# EAGLE design mega_shield2 (EAGLE 7.6.0)
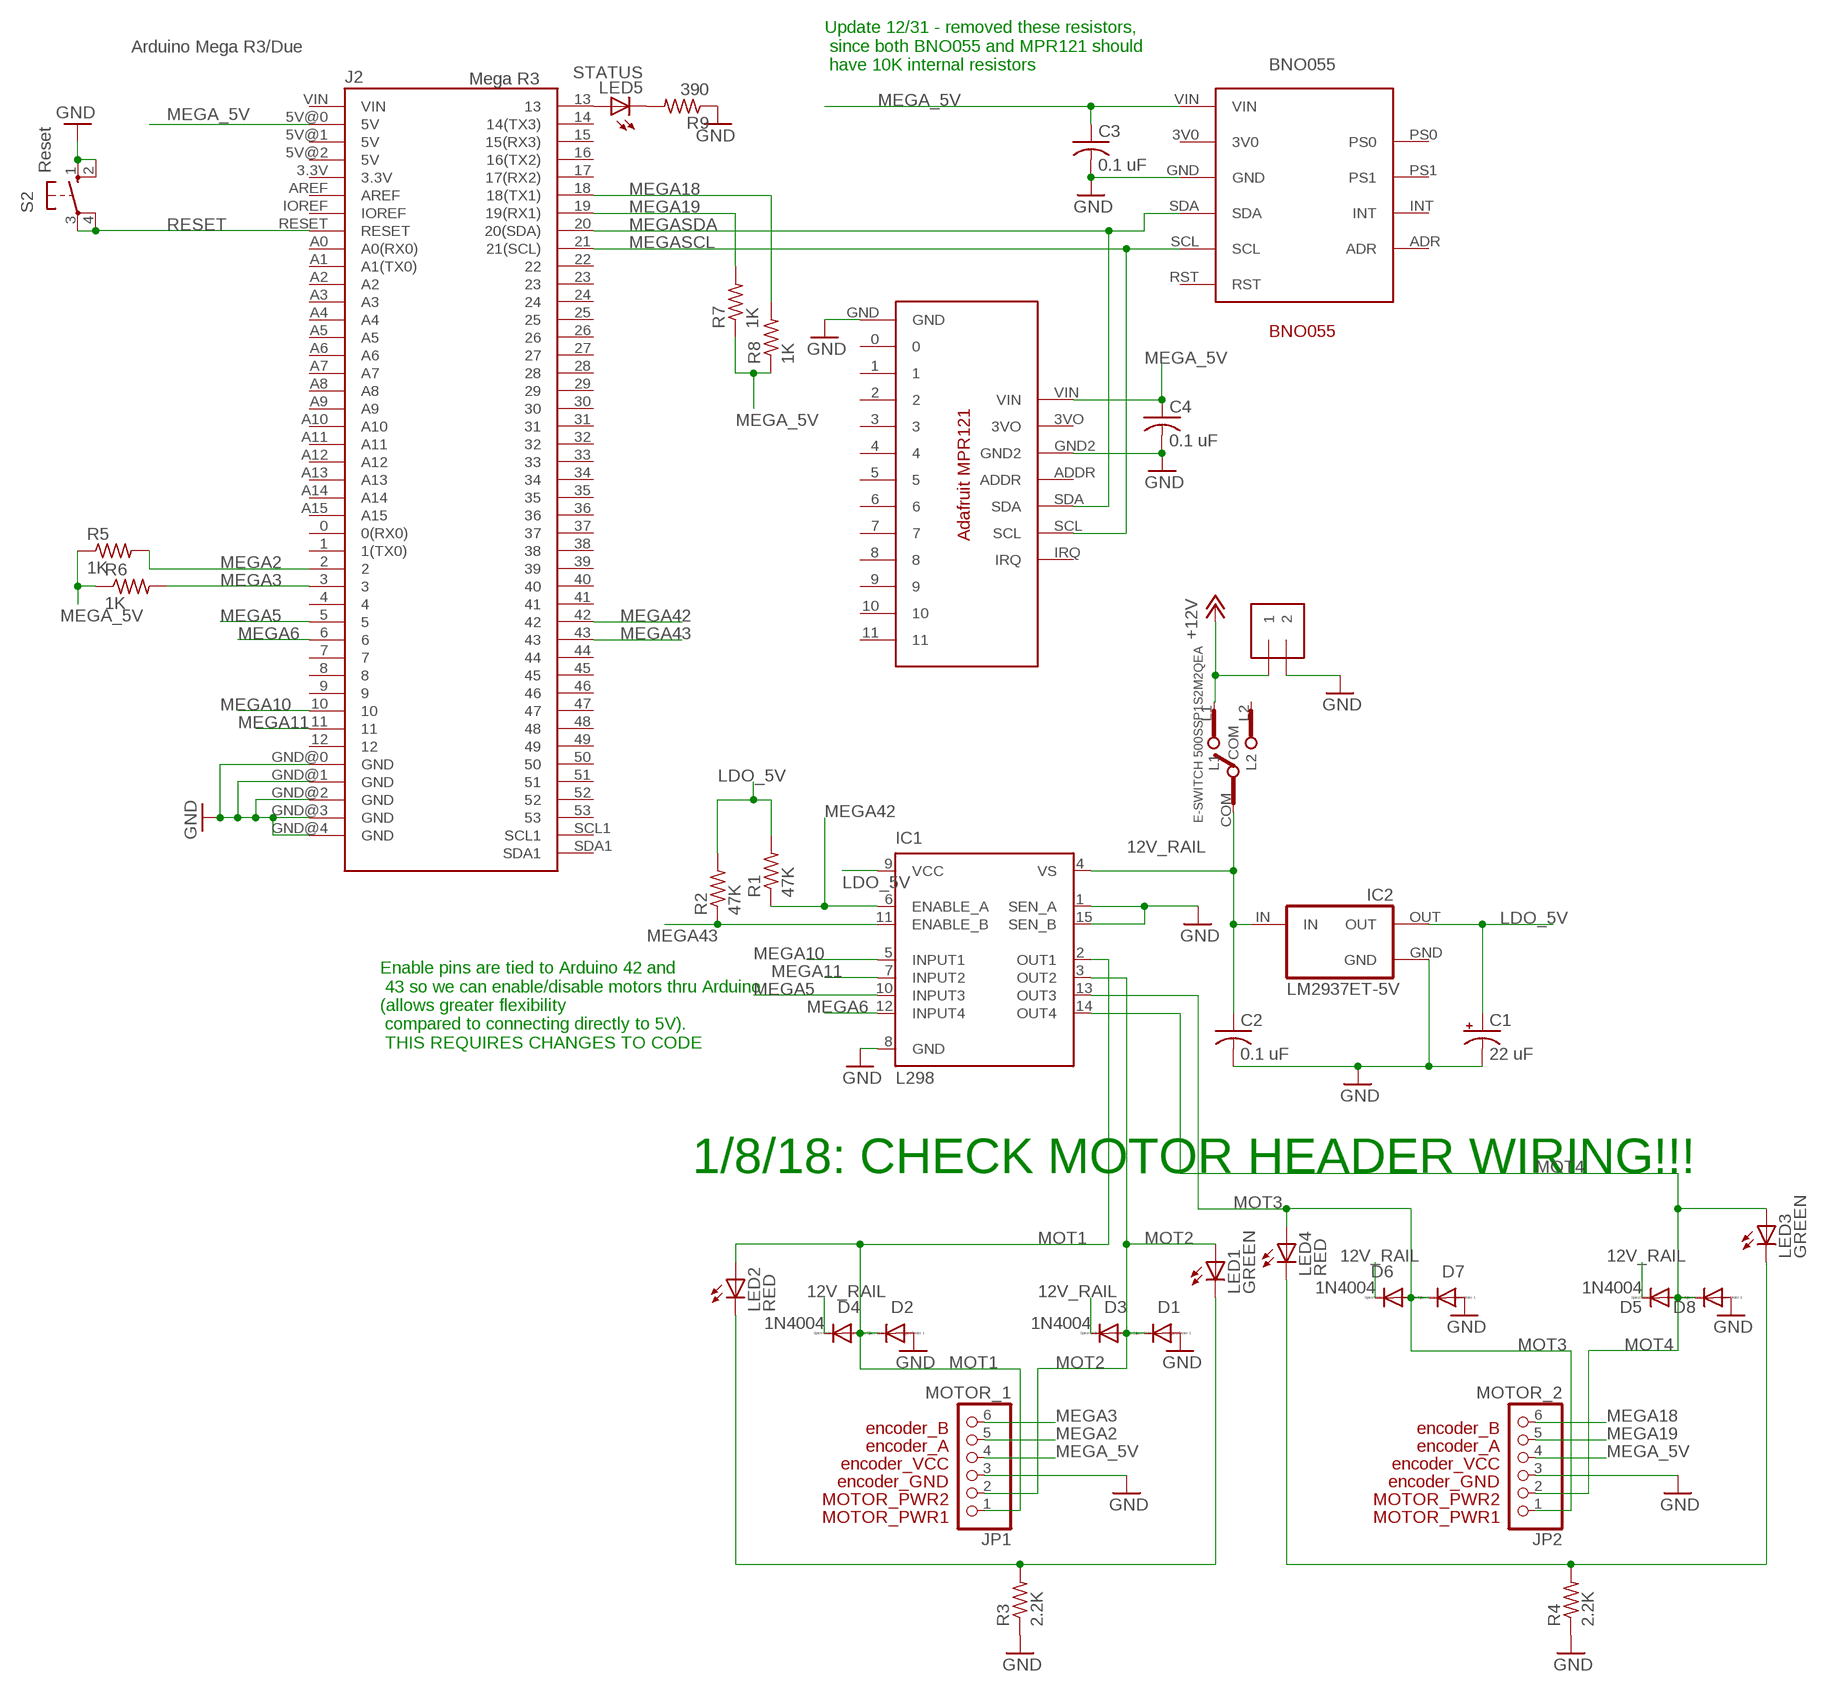
[diagram p0: schematic, sheet 1]

## Parts
12V_IN  1X2-3.5MM  [1X2-3.5MM]
BNO055  BNO055  [BNO055]
C1  22 uF  CPOL-USB45181A  [B45181A]
C2  0.1 uF  C-US025-050X050  [C025-050X050]
C3  0.1 uF  C-US025-050X050  [C025-050X050]
C4  0.1 uF  C-US025-050X050  [C025-050X050]
D1  1N4004  [DO41-10]
D2  1N4004  [DO41-10]
D3  1N4004  [DO41-10]
D4  1N4004  [DO41-10]
D5  1N4004  [DO41-10]
D6  1N4004  [DO41-10]
D7  1N4004  [DO41-10]
D8  1N4004  [DO41-10]
IC1  L298  [MULTIWATT-15]
IC2  LM2937ET-5V  LM2937ET-5,0  [TO220(V)]
J2  Mega R3  ARDUINO-MEGAFULL  [ARDUINO_MEGA]
JP1  MOTOR_1  PINHD-1X6  [1X06]
JP2  MOTOR_2  PINHD-1X6  [1X06]
LED1  GREEN  LED3MM  [LED3MM]
LED2  RED  LED3MM  [LED3MM]
LED3  GREEN  LED3MM  [LED3MM]
LED4  RED  LED3MM  [LED3MM]
LED5  STATUS  LED3MM  [LED3MM]
MPR121  ADA_MPR121  [ADA_MPR121]
R1  47K  R-US_0207/10  [0207/10]
R2  47K  R-US_0207/10  [0207/10]
R3  2.2K  R-US_0207/10  [0207/10]
R4  2.2K  R-US_0207/10  [0207/10]
R5  1K  R-US_0207/10  [0207/10]
R6  1K  R-US_0207/10  [0207/10]
R7  1K  R-US_0207/10  [0207/10]
R8  1K  R-US_0207/10  [0207/10]
R9  390  R-US_0207/10  [0207/10]
S2  Reset  10-XX  [B3F-10XX]
SLIDE_SW  E-SWITCH_500SSP1S2M2QEA  [E-SWITCH_500SSP1S2M2QEA]

## Nets
12V_RAIL [12V_PWR]: C2.1 D3.C D4.C D5.C D6.C IC1.4(VS) IC2.IN SLIDE_SW.COM
+12V [12V_PWR]: 12V_IN.1 SLIDE_SW.L1
GND: 12V_IN.2 BNO055.GND C1.- C2.2 C3.2 C4.2 D1.A D2.A D7.A D8.A IC1.1(SEN_A) IC1.8(GND) IC1.15(SEN_B) IC2.GND J2.GND@0(GND) J2.GND@1(GND) J2.GND@2(GND) J2.GND@3(GND) J2.GND@4(GND) JP1.3 JP2.3 MPR121.GND MPR121.GND2 R3.1 R4.1 R9.1 S2.1(S) S2.2(S1)
LDO_5V [5V_LDO]: C1.+ IC1.9(VCC) IC2.OUT R1.2 R2.2
MEGA2: J2.2 JP1.5 R5.2
MEGA3: J2.3 JP1.6 R6.2
MEGA5: IC1.10(INPUT3) J2.5
MEGA6: IC1.12(INPUT4) J2.6
MEGA10: IC1.5(INPUT1) J2.10
MEGA11: IC1.7(INPUT2) J2.11
MEGA18: J2.18(18(TX1)) JP2.6 R8.2
MEGA19: J2.19(19(RX1)) JP2.5 R7.2
MEGA42: IC1.6(ENABLE_A) J2.42 R1.1
MEGA43: IC1.11(ENABLE_B) J2.43 R2.1
MEGA_5V [5V_LDO]: BNO055.VIN C3.1 C4.1 J2.5V@0(5V) JP1.4 JP2.4 MPR121.VIN R5.1 R6.1 R7.1 R8.1
MEGASCL: BNO055.SCL J2.21(21(SCL)) MPR121.SCL
MEGASDA: BNO055.SDA J2.20(20(SDA)) MPR121.SDA
MOT1 [12V_PWR]: D2.C D4.A IC1.2(OUT1) JP1.1 LED2.A
MOT2 [12V_PWR]: D1.C D3.A IC1.3(OUT2) JP1.2 LED1.A
MOT3 [12V_PWR]: D6.A D7.C IC1.13(OUT3) JP2.1 LED4.A
MOT4 [12V_PWR]: D5.A D8.C IC1.14(OUT4) JP2.2 LED3.A
N$3: J2.13 LED5.A
N$4: LED5.K(C) R9.2
N$7: LED1.K(C) LED2.K(C) R3.2
N$12: LED3.K(C) LED4.K(C) R4.2
RESET: J2.RESET S2.3(P) S2.4(P1)
Unconnected: BNO055.3V0 BNO055.ADR BNO055.INT BNO055.PS0 BNO055.PS1 BNO055.RST J2.0(0(RX0)) J2.1(1(TX0)) J2.3.3V J2.4 J2.5V@1(5V) J2.5V@2(5V) J2.7 J2.8 J2.9 J2.12 J2.14(14(TX3)) J2.15(15(RX3)) J2.16(16(TX2)) J2.17(17(RX2)) J2.22 J2.23 J2.24 J2.25 J2.26 J2.27 J2.28 J2.29 J2.30 J2.31 J2.32 J2.33 J2.34 J2.35 J2.36 J2.37 J2.38 J2.39 J2.40 J2.41 J2.44 J2.45 J2.46 J2.47 J2.48 J2.49 J2.50 J2.51 J2.52 J2.53 J2.A0(A0(RX0)) J2.A1(A1(TX0)) J2.A2 J2.A3 J2.A4 J2.A5 J2.A6 J2.A7 J2.A8 J2.A9 J2.A10 J2.A11 J2.A12 J2.A13 J2.A14 J2.A15 J2.AREF J2.IOREF J2.SCL1 J2.SDA1 J2.VIN MPR121.0 MPR121.1 MPR121.2 MPR121.3 MPR121.3VO MPR121.4 MPR121.5 MPR121.6 MPR121.7 MPR121.8 MPR121.9 MPR121.10 MPR121.11 MPR121.ADDR MPR121.IRQ SLIDE_SW.L2

## Notes on the sheet
- Arduino Mega R3/Due
- Update 12/31 - removed these resistors,
   since both BNO055 and MPR121 should
   have 10K internal resistors
- Enable pins are tied to Arduino 42 and
   43 so we can enable/disable motors thru Arduino 
  (allows greater flexibility
   compared to connecting directly to 5V).
   THIS REQUIRES CHANGES TO CODE
- 1/8/18: CHECK MOTOR HEADER WIRING!!!

## Library data of the parts
12V_IN = adafruit:1X2: 3.5mm Terminal block http://www.ladyada.net/library/pcb/eaglelibrary.html
BNO055 = arduinoShield:BNO055
C1 = rcl:CPOL-US: POLARIZED CAPACITOR, American symbol
C2-C4 = rcl:C-US: CAPACITOR, American symbol
D1-D8 = diode:1N4004: DIODE general purpose rectifier, 1 A
IC1 = st-microelectronics:L298: DUAL FULL-BRIDGE DRIVER; MPN: L298N; OC_FARNELL: 1589425; OC_NEWARK: 32M1527
IC2 = lm2937:LM2937ET*: 400 and 500 mA Low Dropout Voltage Regulator NATIONAL SEMICONDUCTOR created by Peter.Hofmann@ph-tronic.de <mailto:Reter.Hofmann@ph-tronic.de> 10-2004 Rev.0
J2 = zortness:ARDUINO-MEGA: Arduino MegaR3 board footprint. Also works for Due.
JP1 JP2 = adafruit:PINHD-1X6: PIN HEADER
LED1-LED5 = adafruit:LED: LED OSRAM: - CHIPLED LG R971, LG N971, LY N971, LG Q971, LY Q971, LO R971, LY R971 LH N974, LH R974 LS Q976, LO Q976, LY Q976 LO Q996 - Hyper CHIPLED LW Q18S LB Q993, LB Q99A, LB R99A - SideLED LS A670, LO A670, LY A670, LG A670, LP A670 LB A673, LV A673, LT A673, LW A673 LH A674 LY A675 LS A676, LA A676, LO A676, LY A676, LW A676 LS A679, LY A679, LG A679 - Hyper Micro SIDELED® LS Y876, LA Y876, LO Y876, LY Y876 LT Y87S - SmartLED LW L88C, LW L88S LB L89C, LB L89S, LG L890 LS L89K, LO L89K, LY L89K LS L896, LA L896, LO L896, LY L896 - TOPLED LS T670, LO T670, LY T670, LG T670, LP T670 LSG T670, LSP T670, LSY T670, LOP T670, LYG T670 LG T671, LOG T671, LSG T671 LB T673, LV T673, LT T673, LW T673 LH T674 LS T676, LA T676, LO T676, LY T676, LB T676, LH T676, LSB T676, LW T676 LB T67C, LV T67C, LT T67C, LS T67K, LO T67K, LY T67K, LW E67C LS E67B, LA E67B, LO E67B, LY E67B, LB E67C, LV E67C, LT E67C LW T67C LS T679, LY T679, LG T679 LS T770, LO T770, LY T770, LG T770, LP T770 LB T773, LV T773, LT T773, LW T773 LH T774 LS E675, LA E675, LY E675, LS T675 LS T776, LA T776, LO T776, LY T776, LB T776 LHGB T686 LT T68C, LB T68C - Hyper Mini TOPLED® LB M676 - Mini TOPLED Santana® LG M470 LS M47K, LO M47K, LY M47K Source: http://www.osram.convergy.de/
MPR121 = arduinoShield:ADA_MPR121
R1-R9 = rcl:R-US_: RESISTOR, American symbol
S2 = switch-omron:10-XX: OMRON SWITCH; MPN: B3F-1000; OC_FARNELL: 176432; OC_NEWARK: 36M3542
SLIDE_SW = arduinoShield:E-SWITCH_500SSP1S2M2QEA

## Net classes
1 12V_PWR: width 2.159 mm
2 5V_LDO: width 0.305 mm

## Board
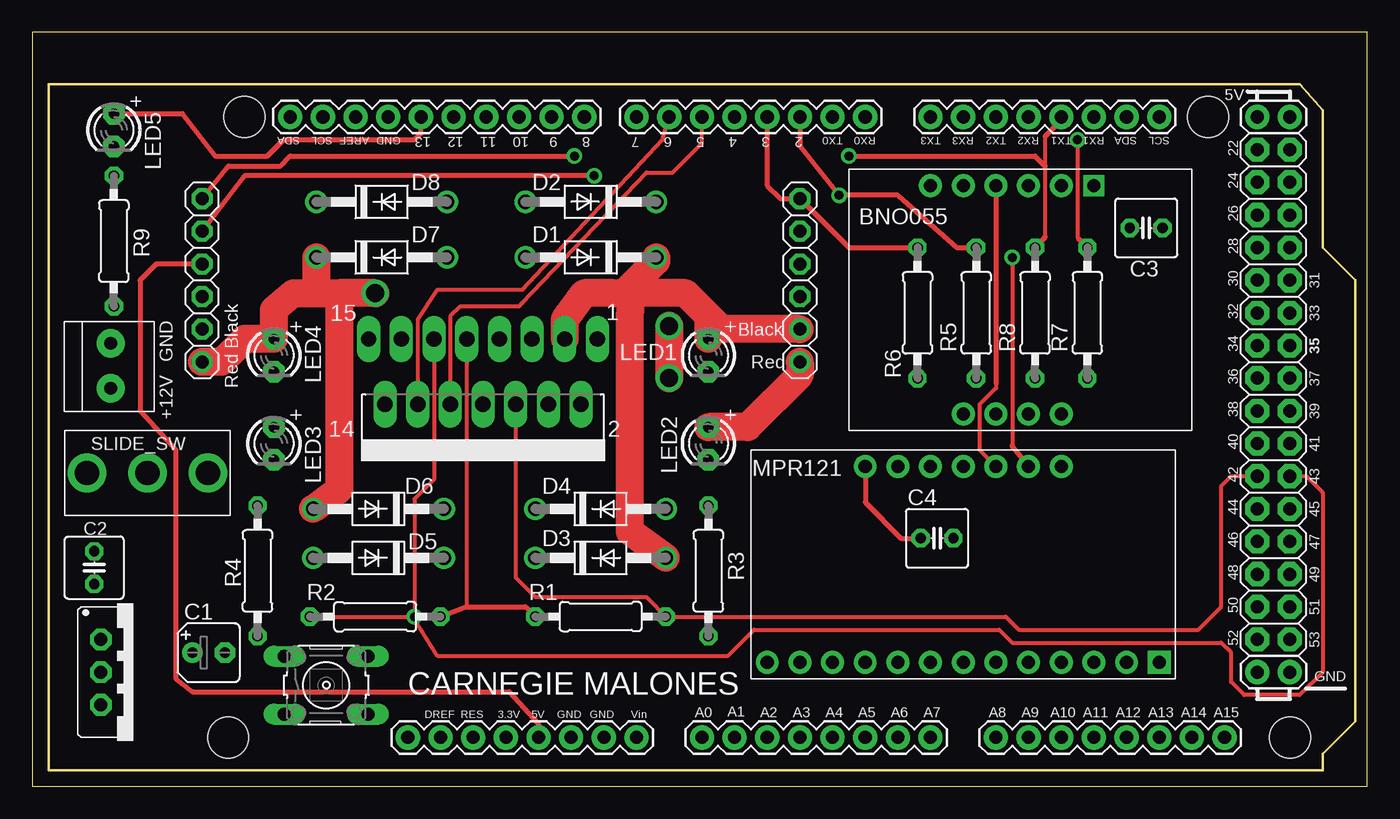
[diagram p1: board, top side]
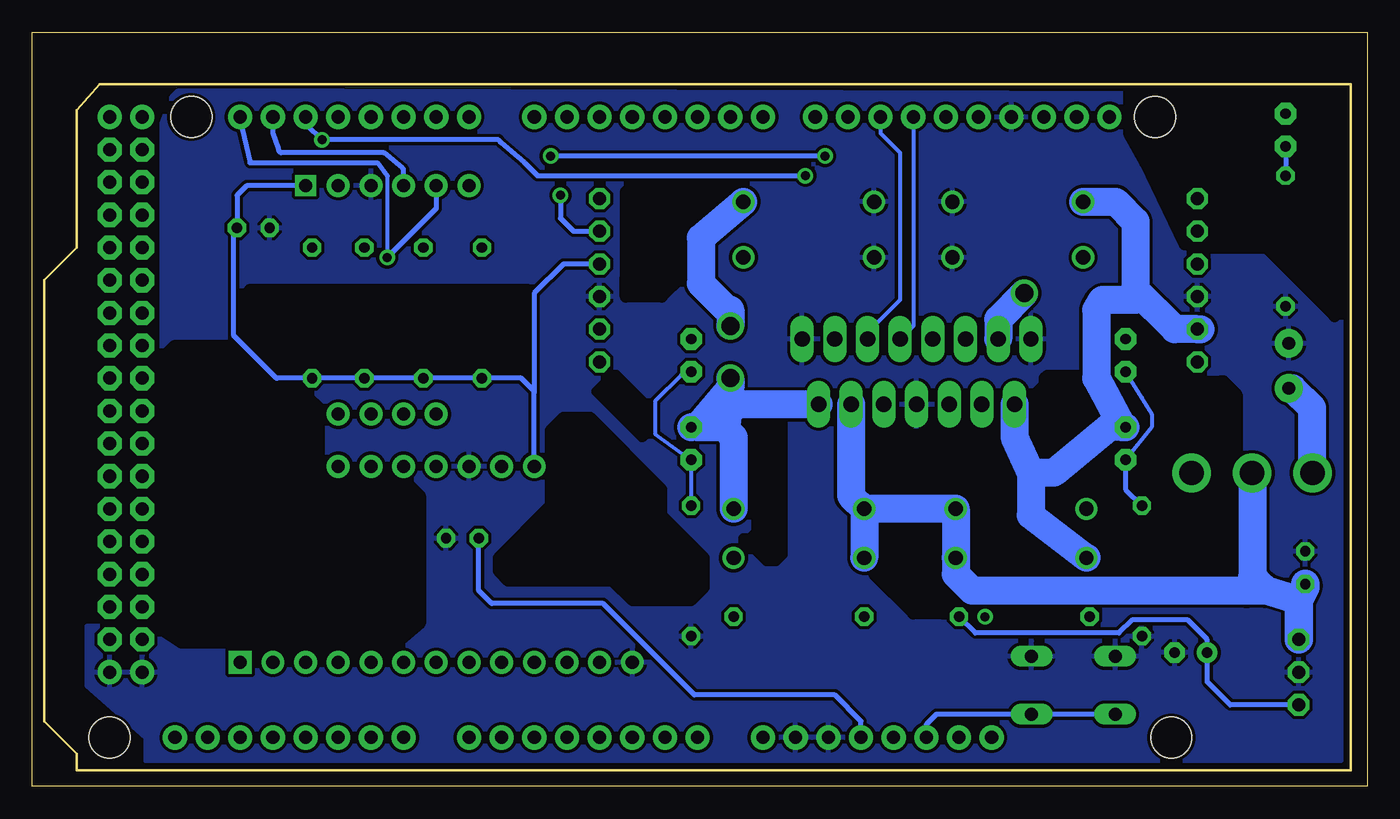
[diagram p2: board, bottom side, seen from below]

Size 103.81 x 58.66 mm. Coordinates in mm from the lower left corner, seen from the top.
Outline: 0,0 103.81,0 103.81,58.66 0,58.66 0,0
Copper layers (1*16): Top 0.035mm / dielectric 1.5mm / Bottom 0.035mm
Design rules "SparkFun": minimum track width 8mil, minimum drill 20mil, track to track 8mil, track to pad 8mil, pad to pad 8mil, via to via 8mil, smd to smd 8mil, copper to edge 10mil, drill to drill 8mil, minimum pad ring 12mil, minimum via ring 10mil, stop-mask expansion 4mil, vias tented up to drill 25mil, thermal gap 10mil
bRestrict: area 56.1,27.2 to 59.9,32; area 45.5,17.5 to 48.5,28.2; area 27.4,17 to 38.6,27.4; area 32,13.5 to 38.4,20.1; area 65.3,32.3 to 87.6,38.6; area 49.8,39.1 to 57.7,47; area 53.3,38.1 to 57.7,40.4; area 73.7,11.2 to 93.7,34.3; area 10.4,16.8 to 17,23.6; area 10.2,23.6 to 16.8,32; 31 lines

### Footprints (pad centres in the part's own frame; a part is rotated, then mirrored left to right if it is on the bottom)
1X2-3.5MM = drill 1 pad 2.184: 1 1.8,0; 2 -1.7,0
BNO055 = drill 1.016 pad 1.778: 3V0 1.27,-10.16; ADR 19.05,-17.78; GND 1.27,-12.7; INT 19.05,-15.24; PS0 19.05,-10.16; PS1 19.05,-12.7; RST 1.27,-20.32; SCL 1.27,-17.78; SDA 1.27,-15.24 | drill 1.016 square: VIN 1.27,-7.62
B45181A = drill 0.813 pad 1.6: + -1.27,0 | drill 0.813 pad 1.6 octagon: - 1.27,0
C025-050X050 = drill 0.813 octagon: 1 -1.27,0; 2 1.27,0
DO41-10 = drill 1.118: A 5.08,0; C -5.08,0
MULTIWATT-15 = drill 1.2 long: 1 -8.89,-7.62; 2 -7.62,-2.54; 3 -6.35,-7.62; 4 -5.08,-2.54; 5 -3.81,-7.62; 6 -2.54,-2.54; 7 -1.27,-7.62; 8 0,-2.54; 9 1.27,-7.62; 10 2.54,-2.54; 11 3.81,-7.62; 12 5.08,-2.54; 13 6.35,-7.62; 14 7.62,-2.54; 15 8.89,-7.62
TO220(V) = drill 1.016 pad 1.676 octagon: GND 0,0; IN -2.54,0; OUT 2.54,0
ARDUINO_MEGA = drill 1.016 pad 1.88: 0 63.5,50.8; 1 60.96,50.8; 2 58.42,50.8; 3 55.88,50.8; 3.3V 35.56,2.54; 4 53.34,50.8; 5 50.8,50.8; 5V@0 38.1,2.54; 5V@1 93.98,50.8; 5V@2 96.52,50.8; 6 48.26,50.8; 7 45.72,50.8; 8 41.656,50.8; 9 39.116,50.8; 10 36.576,50.8; 11 34.036,50.8; 12 31.496,50.8; 13 28.956,50.8; 14 68.58,50.8; 15 71.12,50.8; 16 73.66,50.8; 17 76.2,50.8; 18 78.74,50.8; 19 81.28,50.8; 20 83.82,50.8; 21 86.36,50.8; A0 50.8,2.54; A1 53.34,2.54; A2 55.88,2.54; A3 58.42,2.54; A4 60.96,2.54; A5 63.5,2.54; A6 66.04,2.54; A7 68.58,2.54; A8 73.66,2.54; A9 76.2,2.54; A10 78.74,2.54; A11 81.28,2.54; A12 83.82,2.54; A13 86.36,2.54; A14 88.9,2.54; A15 91.44,2.54; AREF 23.876,50.8; EMPTY 27.94,2.54; GND@0 40.64,2.54; GND@1 43.18,2.54; GND@2 93.98,7.62; GND@3 96.52,7.62; GND@4 26.416,50.8; IOREF 30.48,2.54; RESET 33.02,2.54; SCL1 21.336,50.8; SDA1 18.796,50.8; VIN 45.72,2.54 | drill 1.016 pad 1.88 octagon: 22 93.98,48.26; 23 96.52,48.26; 24 93.98,45.72; 25 96.52,45.72; 26 93.98,43.18; 27 96.52,43.18; 28 93.98,40.64; 29 96.52,40.64; 30 93.98,38.1; 31 96.52,38.1; 32 93.98,35.56; 33 96.52,35.56; 34 93.98,33.02; 35 96.52,33.02; 36 93.98,30.48; 37 96.52,30.48; 38 93.98,27.94; 39 96.52,27.94; 40 93.98,25.4; 41 96.52,25.4; 42 93.98,22.86; 43 96.52,22.86; 44 93.98,20.32; 45 96.52,20.32; 46 93.98,17.78; 47 96.52,17.78; 48 93.98,15.24; 49 96.52,15.24; 50 93.98,12.7; 51 96.52,12.7; 52 93.98,10.16; 53 96.52,10.16 | hole 3.2: 15.24,50.8; 13.97,2.54; 90.17,50.8; 96.52,2.54
1X06 = drill 1.016 octagon: 1 -6.35,0; 2 -3.81,0; 3 -1.27,0; 4 1.27,0; 5 3.81,0; 6 6.35,0
LED3MM = drill 0.813 pad 1.676 octagon: A -1.27,0; K 1.27,0
ADA_MPR121 = drill 1.016 pad 1.778: 0 0,-2.54; 1 0,-5.08; 2 0,-7.62; 3 0,-10.16; 3VO 15.24,-10.16; 4 0,-12.7; 5 0,-15.24; 6 0,-17.78; 7 0,-20.32; 8 0,-22.86; 9 0,-25.4; 10 0,-27.94; ADDR 15.24,-15.24; GND 0,0; GND2 15.24,-12.7; IRQ 15.24,-22.86; SCL 15.24,-20.32; SDA 15.24,-17.78; VIN 15.24,-7.62 | drill 1.016 pad 1.778 square: 11 0,-30.48
0207/10 = drill 0.813 octagon: 1 -5.08,0; 2 5.08,0
B3F-10XX = drill 1.016 long: 1 -3.251,2.261; 2 3.251,2.261; 3 -3.251,-2.261; 4 3.251,-2.261
E-SWITCH_500SSP1S2M2QEA = drill 1.9 pad 3: COM 0.76,-2.61; L1 0.76,2.09; L2 0.76,-7.31

### Placement (x,y rotation side)
12V_IN  6.1,32.77 270 top
BNO055  90.17,48.01 270 top
C1  13.72,10.41 0 top
C2  4.83,17.02 90 top
C3  86.61,43.43 180 top
C4  70.36,19.3 0 top
D1  43.43,41.15 180 top
D2  43.43,45.47 180 top
D3  44.2,17.78 0 top
D4  44.2,21.59 0 top
D5  26.92,17.78 180 top
D6  26.92,21.59 180 top
D7  27.18,41.15 0 top
D8  27.18,45.47 0 top
IC1  35.05,27.18 180 top
IC2  5.33,8.89 270 top
J2  1.27,1.27 0 top
JP1  59.69,39.37 90 top
JP2  13.21,39.37 90 top
LED1  52.58,33.53 270 top
LED2  52.58,26.67 270 top
LED3  18.8,26.67 270 top
LED4  18.8,33.53 270 top
LED5  6.35,51.05 270 top
MPR121  57.15,9.65 90 top
R1  44.2,13.21 180 top
R2  26.67,13.21 0 top
R3  52.58,16.76 90 top
R4  17.53,16.76 90 top
R5  73.41,36.83 90 top
R6  68.83,36.83 90 top
R7  82.04,36.83 90 top
R8  77.98,36.83 90 top
R9  6.35,42.42 90 top
S2  22.86,7.87 0 top
SLIDE_SW  6.35,23.62 90 top

### Tracks (layer width: path | path; a pad name or v marks a point on that pad's centre or on a via)
12V_RAIL
  Bottom 2.159: D6.C D5.C | D6.C D4.C | IC1.4 40.13,22.61 D4.C | D4.C D3.C | D6.C 32,16.51 30.73,15.24 9.4,15.24 | SLIDE_SW.COM 8.96,16.33 8.13,15.49
  Bottom 2.223: C2.1 4.83,15.49 5.33,14.48 | 5.33,14.48 7.87,15.24 | 7.87,15.24 9.4,15.24 | IC2.IN 5.33,14.48 | 8.13,15.49 7.87,15.24
+12V
  Bottom 2.159: 12V_IN.1 5.82,30.97 4.32,29.46 4.32,24.44 SLIDE_SW.L1
GND
  pour Bottom (isolate 0.254): 2.03,53.85 92.46,54.1 92.96,53.59 93.73,51.56 93.73,12.7 99.57,12.45 99.57,7.87 95,3.81 95,2.03 2.03,2.03
LDO_5V
  Top 0.305: IC1.9 33.78,13.97
  Top 0.381: R2.2 33.78,13.97 38.35,13.97 R1.2
  Bottom 0.381: R2.2 30.48,11.94 19.3,11.94 18.29,12.95 13.97,12.95 12.45,11.43 C1.+ 12.45,8.13 10.67,6.35 IC2.OUT
MEGA2  (via drill 0.7)
  Top 0.381: R5.2 71.88,41.91 67.31,45.97 v62.74,45.97 59.69,49.78 J2.2
  Bottom 0.381: v62.74,45.97 62.74,44.2 61.72,43.18 JP1.5
MEGA3
  Top 0.381: J2.3 57.15,46.74 58.17,45.72 JP1.6 63.5,41.91 R6.2
MEGA5
  Top 0.305: IC1.10 32.51,36.58 33.27,37.34 37.85,37.34 38.1,37.59 47.75,47.75 49.78,47.75 52.07,50.04 J2.5
MEGA6
  Top 0.305: IC1.12 29.97,36.32 31.5,38.61 38.1,38.61 49.02,50.29 J2.6
MEGA10
  Bottom 0.305: J2.10 37.85,50.8 36.32,49.28 36.32,37.85 38.86,35.31 IC1.5
MEGA11
  Bottom 0.305: J2.11 35.31,35.81 IC1.7
MEGA18  (via drill 0.7)
  Top 0.305: 78.74,50.55 78.74,48.26 78.74,42.78
  Top 0.381: J2.18 80.01,51.92 arc-45 79.94,51.74 78.74,50.55 | 78.74,42.78 arc-45 78.67,42.6 R8.2 | JP2.6 15.24,48.26 19.3,48.26 20.07,49.02 v42.16,49.02 | v63.5,49.02 77.98,49.02 78.74,48.26
  Bottom 0.381: v42.16,49.02 v63.5,49.02
MEGA19  (via drill 0.7)
  Top 0.305: 81.35,42.6 arc-45 81.28,42.78 v81.28,50.29
  Top 0.381: 81.35,42.6 R7.2 | JP2.5 16.51,47.5 v43.69,47.5
  Bottom 0.381: J2.19 82.48,52 82.48,51.49 v81.28,50.29 67.56,50.29 67.31,50.04 65.53,48.51 64.52,47.5 v43.69,47.5
MEGA42
  Top 0.305: IC1.6 37.59,16.26 39.12,14.73 47.75,14.73 R1.1 75.69,13.21 76.71,12.19 90.68,12.19 92.46,13.97 92.46,23.37 93.22,24.13 J2.42
MEGA43  (via drill 0.7)
  Top 0.305: IC1.11 31.24,23.88 29.72,22.35 v29.72,13.21 | R2.1 v29.72,13.21 | J2.43 99.06,24.13 100.33,22.86 100.33,8.89 98.55,7.11 94.23,7.11 93.22,8.13 93.22,10.41 92.46,11.18 76.2,11.18 75.18,12.19 56.13,12.19 54.1,10.16 31.5,10.16 29.72,12.95 v29.72,13.21
MEGA_5V
  Top 0.381: MPR121.VIN 64.77,22.1 67.56,19.3 C4.1 | JP2.4 9.65,40.64 8.38,39.37 8.38,29.21 11.18,26.16 11.18,8.38 12.45,7.37 37.08,7.37 39.37,4.83 J2.5V@0
  Bottom 0.381: 88.14,42.93 88.14,35.05 84.91,31.82 arc-45 84.73,31.75 R7.1 R8.1 R5.1 R6.1 65.79,31.75 64.84,30.81 arc45 64.77,30.63 | 88.14,42.93 88.14,43.08 arc45 88.06,43.25 C3.1 | BNO055.VIN 87.02,46.74 arc-45 87.2,46.66 87.88,45.97 87.88,43.28 arc45 87.96,43.11 88.14,42.93 | MPR121.VIN 64.77,30.63 | J2.5V@0 39.37,5.08 41.4,7.11 52.32,7.11 59.44,14.22 68.07,14.22 69.09,15.24 C4.1 | 64.77,30.63 64.77,38.35 62.48,40.64 JP1.4
MEGASCL  (via drill 0.7)
  Top 0.305: v76.2,41.15 76.2,26.52
  Top 0.381: 76.2,26.52 arc45 76.27,26.34 MPR121.SCL
  Bottom 0.305: 76.2,47.5 v76.2,41.15
  Bottom 0.381: BNO055.SCL 72.39,44.96 v76.2,41.15 | J2.21 87.63,51.82 86.87,48.51 76.96,48.51 76.2,47.5
MEGASDA
  Top 0.305: 74.93,31.35 74.93,30.99 73.66,29.72 73.66,26.16 MPR121.SDA
  Top 0.381: BNO055.SDA 74.93,31.35
  Bottom 0.381: BNO055.SDA 74.93,47.9 arc-45 75,48.08 76.45,49.28 84.48,49.28 arc45 84.66,49.6 85.09,50.8 J2.20
MOT1  (via drill 1.4)
  Top 2.159: v49.53,35.81 v49.53,31.75 | JP1.1 59.69,32 55.63,27.94 LED2.A
  Bottom 2.159: 49.53,37.08 49.53,36.83 | 49.53,36.83 v49.53,35.81 | v49.53,31.75 49.53,30.99 52.07,27.94 | 52.07,27.94 LED2.A | 52.07,27.94 50.29,27.94 | 50.29,27.94 50.04,27.94 49.28,27.18 D4.A | IC1.2 49.02,29.72 50.29,28.45 49.78,28.45 50.29,27.94 | D2.C 51.82,42.67 51.82,39.12 49.53,36.83
MOT2
  Top 2.159: D3.A 46.48,19.81 46.48,36.58 46.61,38.23 | 46.61,38.23 45.95,38.29 | 45.95,38.29 45.21,38.35 42.93,38.35 41.4,36.32 IC1.3 | LED1.A 52.58,36.58 | 52.58,36.58 50.8,38.35 46.48,38.35 46.61,38.23 | D1.C 48.51,40.86 45.95,38.29 | JP1.2 53.59,35.56 52.58,36.58
MOT3  (via drill 1.4)
  Top 2.159: v26.67,38.35 23.88,38.35 | 23.88,38.35 23.88,23.11 D6.A | JP2.1 14.73,33.02 16.51,34.8 LED4.A 18.8,37.08 20.32,38.35 21.59,38.35 | 21.59,38.35 23.88,38.35 | D7.C 22.1,38.86 21.59,38.35
  Bottom 2.159: IC1.13 28.7,36.32 v26.67,38.35
MOT4
  Bottom 2.159: 19.05,27.94 21.08,31.75 21.08,37.08 20.7,37.72 20.57,37.85 18.03,37.85 18.03,38.61 | LED3.A 19.05,27.94 | 19.05,27.94 20.07,27.94 24.38,24.38 26.16,24.38 | 26.16,24.38 26.16,21.08 D5.A | IC1.14 27.43,27.18 26.16,24.38 | 12.95,35.56 JP2.2 14.99,35.56 18.03,38.61 | D8.C 19.56,45.47 18.03,43.94 18.03,38.61
N$3
  Top 0.381: LED5.A 11.68,52.32 14.22,49.02 18.29,49.02 19.56,50.29 29.72,50.29 30.23,50.8 J2.13
N$4
  Bottom 0.381: LED5.K R9.2
N$7
  Bottom 0.305: R3.2 LED2.K 55.37,27.43 55.37,29.97 53.34,32 LED1.K
N$12
  Bottom 0.305: LED4.K 17.53,30.23 16.76,28.96 16.76,27.94 LED3.K
  Bottom 0.381: LED3.K 18.8,23.11 R4.2
RESET
  Bottom 0.381: S2.3 S2.4 33.5,5.61 34.29,4.83 J2.RESET

### Text on the board
tNames: Black | Black | GND | Red | +12V | Red | CARNEGIE MALONES